# Altium project VOC_Sensor.PrjPcb
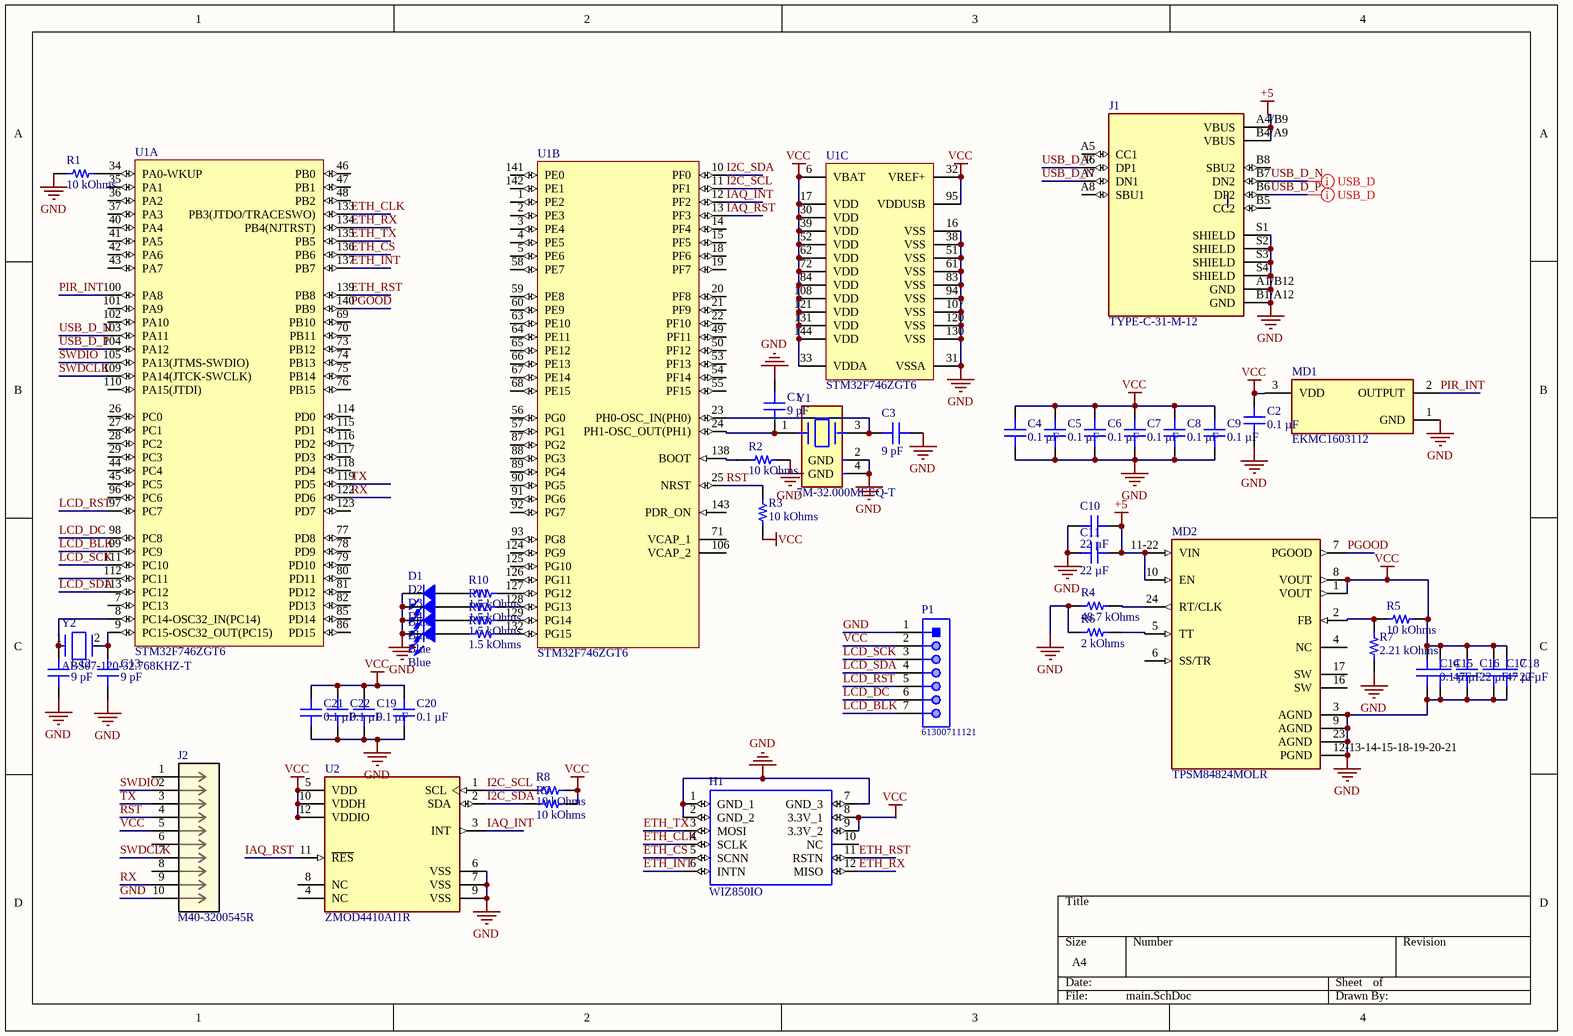
[diagram p0: main.SchDoc]
1 sheet, 49 parts. Net scope: global (net labels, ports and power ports of the same name join across sheets).
Board file: PCB.PcbDoc

## Sheet main.SchDoc
size A4; SheetNumber: 1; SheetTotal: 1

### Parts
C1  9 pF  [CAP 0402_1005]
C2  0.1 µF  [CAP 0402_1005]
C3  9 pF  [CAP 0402_1005]
C4  0.1 µF  [CAP 0402_1005]
C5  0.1 µF  [CAP 0402_1005]
C6  0.1 µF  [CAP 0402_1005]
C7  0.1 µF  [CAP 0402_1005]
C8  0.1 µF  [CAP 0402_1005]
C9  0.1 µF  [CAP 0402_1005]
C10  22 µF  [CAP 0603_1608]
C11  22 µF  [CAP 0603_1608]
C12  9 pF  [CAP 0402_1005]
C13  9 pF  [CAP 0402_1005]
C14  0.1 µF  [CAP 0402_1005]
C15  47 µF  [CAP 1210_3225 - 1MM]
C16  22 µF  [CAP 0603_1608]
C17  47 µF  [CAP 1210_3225 - 1MM]
C18  22 µF  [CAP 0603_1608]
C19  0.1 µF  [CAP 0402_1005]
C20  0.1 µF  [CAP 0402_1005]
C21  0.1 µF  [CAP 0402_1005]
C22  0.1 µF  [CAP 0402_1005]
D1  Blue  [LED 0402_1005 BLUE]
D2  Blue  [LED 0402_1005 BLUE]
D3  Blue  [LED 0402_1005 BLUE]
D4  Blue  [LED 0402_1005 BLUE]
H1  WIZ850IO  [WIZ850IO]
J1  TYPE-C-31-M-12  [HRO_TYPE-C-31-M-12]
J2  M40-3200545R  [CONN10_M40-3200545R_HRW]
MD1  EKMC1603112  [FP-EKMC1603112-MFG]
MD2  TPSM84824MOLR  [FP-MOL0024A-MFG]
P1  61300711121  [61300711121]
R1  10 kOhms  [RES 0402_1005]
R2  10 kOhms  [RES 0402_1005]
R3  10 kOhms  [RES 0402_1005]
R4  48.7 kOhms  [RES 0402_1005]
R5  10 kOhms  [RES 0402_1005]
R6  2 kOhms  [RES 0402_1005]
R7  2.21 kOhms  [RES 0402_1005]
R8  10 kOhms  [RES 0402_1005]
R9  10 kOhms  [RES 0402_1005]
R10  1.5 kOhms  [RES 0402_1005]
R11  1.5 kOhms  [RES 0402_1005]
R12  1.5 kOhms  [RES 0402_1005]
R13  1.5 kOhms  [RES 0402_1005]
U1  STM32F746ZGT6  [STM-LQFP144_V]  (parts A,B,C of 3)
U2  ZMOD4410AI1R  [FP-LGG12D1-MFG]
Y1  7M-32.000MEEQ-T  [FP-7M-MFG]
Y2  ABS07-120-32.768KHZ-T  [FP-ABS07-120-MFG]

### Nets
+5: C10.1 C11.1 J1.A4/B9(VBUS) J1.B4/A9(VBUS) MD2.10(EN) MD2.11-22(VIN)
GND: C1.2 C2.2 C3.2 C4.1 C5.1 C6.1 C7.1 C8.1 C9.1 C10.2 C11.2 C13.2 C14.1 C15.1 C16.1 C17.1 C18.1 C19.1 C20.1 C21.1 C22.1 D1.2 D2.2 D3.2 D4.2 H1.1(GND_1) H1.2(GND_2) H1.7(GND_3) J1.A1/B12(GND) J1.B1/A12(GND) J1.S1(SHIELD) J1.S2(SHIELD) J1.S3(SHIELD) J1.S4(SHIELD) J2.10 MD1.1(GND) MD2.3(AGND) MD2.9(AGND) MD2.12-13-14-15-18-19-20-21(PGND) MD2.23(AGND) P1.1 R1.2 R2.2 R4.1 R6.1 R7.1 U1.16(VSS) U1.31(VSSA) U1.38(VSS) U1.51(VSS) U1.61(VSS) U1.83(VSS) U1.94(VSS) U1.107(VSS) U1.120(VSS) U1.130(VSS) U2.6(VSS) U2.7(VSS) U2.9(VSS) Y1.2(GND) Y1.4(GND)
VCC: C2.1 C4.2 C5.2 C6.2 C7.2 C8.2 C9.2 C14.2 C15.2 C16.2 C17.2 C18.2 C19.2 C20.2 C21.2 C22.2 H1.8(3.3V_1) H1.9(3.3V_2) J2.5 MD1.3(VDD) MD2.1(VOUT) MD2.8(VOUT) P1.2 R3.1 R5.2 R8.1 R9.1 U1.6(VBAT) U1.17(VDD) U1.30(VDD) U1.32(VREF+) U1.33(VDDA) U1.39(VDD) U1.52(VDD) U1.62(VDD) U1.72(VDD) U1.84(VDD) U1.95(VDDUSB) U1.108(VDD) U1.121(VDD) U1.131(VDD) U1.144(VDD) U2.5(VDD) U2.10(VDDH) U2.12(VDDIO)
ETH_CLK: H1.4(SCLK) U1.133(PB3(JTDO/TRACESWO))
ETH_CS: H1.5(SCNN) U1.136(PB6)
ETH_INT: H1.6(INTN) U1.137(PB7)
ETH_RST: H1.11(RSTN) U1.139(PB8)
ETH_RX: H1.12(MISO) U1.134(PB4(NJTRST))
ETH_TX: H1.3(MOSI) U1.135(PB5)
I2C_SCL: R8.2 U1.11(PF1) U2.1(SCL)
I2C_SDA: R9.2 U1.10(PF0) U2.2(SDA)
IAQ_INT: U1.12(PF2) U2.3(INT)
IAQ_RST: U1.13(PF3) U2.11(~{RES})
LCD_BLK: P1.7 U1.99(PC9)
LCD_DC: P1.6 U1.98(PC8)
LCD_RST: P1.5 U1.97(PC7)
LCD_SCK: P1.3 U1.111(PC10)
LCD_SDA: P1.4 U1.113(PC12)
PGOOD: MD2.7(PGOOD) U1.140(PB9)
PIR_INT: MD1.2(OUTPUT) U1.100(PA8)
RST: J2.4 R3.2 U1.25(NRST)
RX: J2.9 U1.122(PD6)
SWDCLK: J2.7 U1.109(PA14(JTCK-SWCLK))
SWDIO: J2.2 U1.105(PA13(JTMS-SWDIO))
TX: J2.3 U1.119(PD5)
USB_D_N: J1.A7(DN1) J1.B7(DN2) U1.103(PA11)
USB_D_P: J1.A6(DP1) J1.B6(DP2) U1.104(PA12)
NetC1_1: C1.1 U1.24(PH1-OSC_OUT(PH1)) Y1.1
NetC3_1: C3.1 U1.23(PH0-OSC_IN(PH0)) Y1.3
NetC12_1: C12.1 U1.8(PC14-OSC32_IN(PC14)) Y2.1
NetC13_1: C13.1 U1.9(PC15-OSC32_OUT(PC15)) Y2.2
NetD1_1: D1.1 R10.1
NetD2_1: D2.1 R11.1
NetD3_1: D3.1 R12.1
NetD4_1: D4.1 R13.1
NetMD2_2: MD2.2(FB) R5.1 R7.2
NetMD2_5: MD2.5(TT) R6.2
NetMD2_24: MD2.24(RT/CLK) R4.2
NetR1_1: R1.1 U1.34(PA0-WKUP)
NetR2_1: R2.1 U1.138(BOOT)
NetR10_2: R10.2 U1.127(PG12)
NetR11_2: R11.2 U1.128(PG13)
NetR12_2: R12.2 U1.129(PG14)
NetR13_2: R13.2 U1.132(PG15)

Not connected (* = marked no-connect by the designer): C12 2; H1 10(NC); J1 A5(CC1) A8(SBU1) B5(CC2) B8(SBU2); J2 1 6 8; MD2 4(NC) 6(SS/TR) 16(SW) 17(SW); U1 1(PE2) 2(PE3) 3(PE4) 4(PE5) 5(PE6) 7(PC13) 14(PF4) 15(PF5) 18(PF6) 19(PF7) 20(PF8) 21(PF9) 22(PF10) 26(PC0) 27(PC1) 28(PC2) 29(PC3) 35(PA1) 36(PA2) 37(PA3) 40(PA4) 41(PA5) 42(PA6) 43(PA7) 44(PC4) 45(PC5) 46(PB0) 47(PB1) 48(PB2) 49(PF11) 50(PF12) 53(PF13) 54(PF14) 55(PF15) 56(PG0) 57(PG1) 58(PE7) 59(PE8) 60(PE9) 63(PE10) 64(PE11) 65(PE12) 66(PE13) 67(PE14) 68(PE15) 69(PB10) 70(PB11) 71(VCAP_1) 73(PB12) 74(PB13) 75(PB14) 76(PB15) 77(PD8) 78(PD9) 79(PD10) 80(PD11) 81(PD12) 82(PD13) 85(PD14) 86(PD15) 87(PG2) 88(PG3) 89(PG4) 90(PG5) 91(PG6) 92(PG7) 93(PG8) 96(PC6) 101(PA9) 102(PA10) 106(VCAP_2) 110(PA15(JTDI)) 112(PC11) 114(PD0) 115(PD1) 116(PD2) 117(PD3) 118(PD4) 123(PD7) 124(PG9) 125(PG10) 126(PG11) 141(PE0) 142(PE1) 143(PDR_ON); U2 4(NC) 8(NC)

### Layout directives
differential pair: USB_D_N, USB_D_P

### Notes on the sheet
- Labels drawn without touching a wire or pin: GND

### Library data of the parts
C1 C3 C12 C13 = 0402N9R0D500CT: CAP CER 9PF 50V C0G/NP0 0402; manufacturer: Walsin Technology Corporation; Temperature Coefficient: C0G, NP0; Tolerance: ±0.5pF; Part Number: 0402N9R0D500CT; Value: 9 pF; Applications: General Purpose; Capacitance: 9 pF; componentlink1description: Datasheet; componentlink1url: http://www.passivecomponent.com/wp-content/uploads/2018/10/MLCC.pdf; componentlink2description: DigiKey Link; componentlink2url: https://www.digikey.com/en/products/detail/walsin-technology-corporation/0402N9R0D500CT/9354861; Device Package: 0402 (1005 Metric); lastupdated: 19/9/2022 12:57:29 pm; Lifecycle Status: Active; Minimum Order: 1; Mounting Type: Surface Mount, MLCC; Operating Temperature: -55°C ~ 125°C; Package / Case: 0402 (1005 Metric); packaging: CutTape; partid: 3535; Part Status: Active; price: 0.01; series: -; Size / Dimension: 0.039" L x 0.020" W (1.00mm x 0.50mm); Supplier 1: DigiKey; Supplier Part Number 1: 1292-1364-1-ND; Thickness (Max): 0.022" (0.55mm); Voltage - Rated: 50V
C2 C4-C9 C14 C19-C22 = 885012105001: CAP CER 0.1UF 6.3V X5R 0402; manufacturer: Würth Elektronik; Tolerance: ±20%; Part Number: 885012105001; Value: 0.1 µF; Applications: General Purpose; Capacitance: 0.1 µF; componentlink1description: Datasheet; componentlink1url: https://katalog.we-online.de/pbs/datasheet/885012105001.pdf; componentlink2description: DigiKey Link; componentlink2url: https://www.digikey.com/en/products/detail/würth-elektronik/885012105001/5453333; Device Package: 0402 (1005 Metric); lastupdated: 19/9/2022 12:57:34 pm; Lifecycle Status: Active; Minimum Order: 1; Mounting Type: Surface Mount, MLCC; Operating Temperature: -55°C ~ 85°C; Package / Case: 0402 (1005 Metric); packaging: TapeAndReel; partid: 1931; Part Status: Active; price: 0.01; series: WCAP-CSGP; Size / Dimension: 0.039" L x 0.020" W (1.00mm x 0.50mm); Supplier 1: DigiKey; Supplier Part Number 1: 732-7478-1-ND; Temperature Coefficient: X5R; Thickness (Max): 0.022" (0.55mm); Voltage - Rated: 6.3V
C10 C11 C16 C18 = ZRB18AR61A226ME01L: CAP CER 22UF 10V X5R 0603; manufacturer: Murata Electronics; Tolerance: ±20%; Part Number: ZRB18AR61A226ME01L; Value: 22 µF; Applications: Acoustic Noise Reduction; Capacitance: 22 µF; componentlink1description: Datasheet; componentlink1url: https://search.murata.co.jp/Ceramy/image/img/A01X/G101/ENG/ZRB18AR61A226ME01-02.pdf; componentlink2description: DigiKey Link; componentlink2url: https://www.digikey.com/en/products/detail/murata-electronics/ZRB18AR61A226ME01L/7243452; Device Package: 0603 (1608 Metric); Features: Interposer Termination; lastupdated: 19/9/2022 1:00:06 pm; Lifecycle Status: Active; Minimum Order: 1; Mounting Type: Surface Mount, MLCC; Operating Temperature: -55°C ~ 85°C; Package / Case: 0603 (1608 Metric); packaging: TapeAndReel; partid: 34379; Part Status: Active; price: 0.07; series: ZRB; Size / Dimension: 0.063" L x 0.031" W (1.60mm x 0.80mm); Supplier 1: DigiKey; Supplier Part Number 1: 490-ZRB18AR61A226ME01LCT-ND; Temperature Coefficient: X5R; Thickness (Max): 0.047" (1.20mm); Voltage - Rated: 10V
C15 C17 = GRM32EC81C476KE15L: CAP CER 47UF 16V X6S 1210; manufacturer: Murata Electronics; Tolerance: ±10%; Part Number: GRM32EC81C476KE15L; Value: 47 µF; Applications: General Purpose; Capacitance: 47 µF; componentlink1description: Datasheet; componentlink1url: https://search.murata.co.jp/Ceramy/image/img/A01X/G101/ENG/GRM32EC81C476KE15-01.pdf; componentlink2description: DigiKey Link; componentlink2url: https://www.digikey.com/en/products/detail/murata-electronics/GRM32EC81C476KE15L/5027615; Device Package: 1210 (3225 Metric); lastupdated: 19/9/2022 1:23:34 pm; Lifecycle Status: Active; Minimum Order: 1; Mounting Type: Surface Mount, MLCC; Operating Temperature: -55°C ~ 105°C; Package / Case: 1210 (3225 Metric); packaging: TapeAndReel; partid: 23627; Part Status: Active; price: 0.13; series: GRM; Size / Dimension: 0.126" L x 0.098" W (3.20mm x 2.50mm); Supplier 1: DigiKey; Supplier Part Number 1: 490-10531-1-ND; Temperature Coefficient: X6S; Thickness (Max): 0.106" (2.70mm); Voltage - Rated: 16V
D1-D4 = B1811NB--05D000113U1930: 1.0(L)X0.5(W)X0.25(H) MM; Manufacturer: Harvatek Corporation; Current - Test: 5mA; Lens Size: 1.00mm x 0.50mm; Lens Style: Rectangle with Flat Top; Lens Transparency: Diffused; Millicandela Rating: 28.5mcd; Viewing Angle: 100°, 130°; Voltage - Forward (Vf) (Typ): 2.8V; Wavelength - Dominant: 472nm; Wavelength - Peak: 470nm; Part Number: B1811NB--05D000113U1930; Color: Blue; ComponentLink1Description: Datasheet; ComponentLink1URL: https://media.digikey.com/pdf/Data%20Sheets/Harvatek%20PDFs/B1811NB--05D000113U1930.pdf; ComponentLink2Description: DigiKey Link; ComponentLink2URL: https://www.digikey.com/en/products/detail/harvatek-corporation/B1811NB-05D000113U1930/16573079; Device Package: 0402 (1005 Metric); Height (Max): 0.35mm; LastUpdated: 19/9/2022 1:49:16 pm; Lifecycle Status: Active; Minimum Order: 1; Mounting Type: Surface Mount; Package / Case: 0402 (1005 Metric); Packaging: TapeAndReel; PartId: 1112; Part Status: Active; Price: 0.09; Series: -; Size / Dimension: 1.00mm L x 0.50mm W; Supplier 1: DigiKey; Supplier Part Number 1: 3147-B1811NB--05D000113U1930CT-ND; Value: Blue
H1 = WIZ850IO: Ethernet - 10/100 Base-T/TX PHY SPI Interface Module; MF: WIZnet; Value: *; Package: Module WIZnet; Availability: In Stock; Check_prices: https://www.snapeda.com/parts/WIZ850IO/WIZnet/view-part/?ref=eda; SnapEDA_Link: https://www.snapeda.com/parts/WIZ850IO/WIZnet/view-part/?ref=snap; Purchase-URL: https://pricing.snapeda.com/search/part/WIZ850IO/?ref=eda; MP: WIZ850IO; Price: None
J1 = TYPE-C-31-M-12: USB Connectors 24 Receptacle 1 8.94*7.3mm RoHS; MF: HRO Electronics Co., Ltd.; Package: Package; Price: None; Availability: Not in stock; Check_prices: https://www.snapeda.com/parts/TYPE-C-31-M-12/HRO+Electronics+Co.%252C+Ltd./view-part/?ref=eda; MP: TYPE-C-31-M-12; SnapEDA_Link: https://www.snapeda.com/parts/TYPE-C-31-M-12/HRO+Electronics+Co.%252C+Ltd./view-part/?ref=snap; Value: *
J2 = M40-3200545R: No Description Available; Mfr_Name: Harwin; Copyright: Copyright (C) 2022 Ultra Librarian. All rights reserved.; Manufacturer_Part_Number: M40-3200545R; RefDes: RefDes; Type: DEV
MD1 = CMP-05541-000002-1: SENSOR MOTION PIR 12M RANGE BLK; Manufacturer: Panasonic Electric Works; Sensor Output: TTL; Min Supply Voltage: 3V; Operating Supply Current: 170uA; Max Supply Voltage: 6V; ComponentLink2Description: Datasheet; Ambient Temperature Range High: +60°C; Digikey Description: SENSOR MOTION PIR 12M RANGE BLK; Device Class L3: unset; ComponentLink2URL: https://www3.panasonic.biz/ac/ae/search_num/index.jsp?c=detail&part_no=EKMC1603112; Category: UNK; Height: 20.2mm; Octopart: https://octopart.com/ekmc1603112-panasonic-19688871; Ambient Temperature Range Low: -20°C; Lead Free: Yes; Automotive: No; Package: 0; RoHS: TRUE; Device Class L1: Sensors; Mouser Description: Board Mount Motion & Position Sensors 170uA 12m Digital Black lens; Device Class L2: Motion Sensors; Manufacturer Part Number: EKMC1603112
MD2 = CMP-04918-000322-1: DC DC CONVERTER 0.6-10V; Max Input Voltage: 17V; Voltage - Output 1: 10V; Number of Outputs: 1; Min Input Voltage: 4.5V; Max Output Current: 8A; Efficiency: 94%; Mount: Surface Mount; Max Operating Temperature: 105°C; Min Operating Temperature: -40°C; RoHS Compliant: Yes; Packaging: Tape and Reel; Case/Package: SMD/SMT; Features: UVLO
P1 = CMP-1502-01074-1: THT Vertical Pin Header WR-PHD, Pitch 2.54 mm, Single Row, 7 pins; Manufacturer: Wurth Elektronik; Pin Number: 7; Gender: Male; Working Voltage: 250VAC; Contact Resistance: 20mOhm; Rated Current: 3A; Pitch: 2.54mm; Withstanding Voltage: 500VAC; Row Number: Single; Packaging: Bag; Orientation: Vertical; Manufacturer URL: http://www.we-online.de; Datasheet URL: https://katalog.we-online.de/em/datasheet/6130xx11121.pdf; Part Number: 61300711121; Publisher: WurthElektronik; Operating Temperature: -40to105degC; Mounting Technology: THT; Package Reference: 61300711121
R1-R3 R5 R8 R9 = AC0402FR-7W10KL: RES 10 KOHM 1% 1/8W 0402; Manufacturer: Yageo; Power (Watts): 0.125W, 1/8W; Temperature Coefficient: ±100ppm/°C; Part Number: AC0402FR-7W10KL; Value: 10 kOhms; ComponentLink1Description: Datasheet; ComponentLink1URL: https://www.yageo.com/upload/media/product/productsearch/datasheet/rchip/PYu-AC_51_RoHS_L_8.pdf; ComponentLink2Description: DigiKey Link; ComponentLink2URL: https://www.digikey.com/en/products/detail/yageo/AC0402FR-7W10KL/12698852; Composition: Thick Film; Device Package: 0402 (1005 Metric); Features: Automotive AEC-Q200, Moisture Resistant; Height - Seated (Max): 0.015" (0.37mm); LastUpdated: 19/9/2022 1:13:40 pm; Lifecycle Status: Active; Minimum Order: 1; Number of Terminations: 2; Operating Temperature: -55°C ~ 155°C; Package / Case: 0402 (1005 Metric); Packaging: CutTape; PartId: 66973; Part Status: Active; Price: 0.01; Ratings: AEC-Q200; Resistance: 10 kOhms; Series: AC; Size / Dimension: 0.039" L x 0.020" W (1.00mm x 0.50mm); Supplier 1: DigiKey; Supplier Part Number 1: 13-AC0402FR-7W10KLCT-ND; Supplier Device Package: 0402; Tolerance: ±1%
R4 = RP73PF1E48K7BTD: RES 48.7K OHM 0.1% 1/10W 0402; Manufacturer: TE Connectivity Passive Product; Power (Watts): 0.1W, 1/10W; Temperature Coefficient: ±25ppm/°C; Part Number: RP73PF1E48K7BTD; Value: 48.7 kOhms; ComponentLink1Description: Datasheet; ComponentLink1URL: https://www.te.com/commerce/DocumentDelivery/DDEController?Action=srchrtrv&DocNm=1773272&DocType=DS&DocLang=English; ComponentLink2Description: DigiKey Link; ComponentLink2URL: https://www.digikey.com/en/products/detail/te-connectivity-passive-product/RP73PF1E48K7BTD/8261023; Composition: Thin Film; Device Package: 0402 (1005 Metric); Height - Seated (Max): 0.014" (0.35mm); LastUpdated: 19/9/2022 1:14:09 pm; Lifecycle Status: Active; Minimum Order: 1; Number of Terminations: 2; Operating Temperature: -55°C ~ 155°C; Package / Case: 0402 (1005 Metric); Packaging: TapeAndReel; PartId: 19282; Part Status: Active; Price: 0.09; Resistance: 48.7 kOhms; Series: RP73, Holsworthy; Size / Dimension: 0.039" L x 0.020" W (1.00mm x 0.50mm); Supplier 1: DigiKey; Supplier Part Number 1: A127481CT-ND; Supplier Device Package: 0402; Tolerance: ±0.1%
R6 = RE0402BRE072KL: CHIP RESISTOR THICK FILM PRECISI; Manufacturer: Yageo; Power (Watts): 0.063W, 1/16W; Temperature Coefficient: ±50ppm/°C; Tolerance: ±0.1%; Part Number: RE0402BRE072KL; Value: 2 kOhms; ComponentLink1Description: Datasheet; ComponentLink1URL: https://www.yageo.com/upload/media/product/productsearch/datasheet/rchip/PYu-RE_105_RoHS_L_6.pdf; ComponentLink2Description: DigiKey Link; ComponentLink2URL: https://www.digikey.com/en/products/detail/yageo/RE0402BRE072KL/15220230; Composition: Thick Film; Device Package: 0402 (1005 Metric); Height - Seated (Max): 0.015" (0.37mm); LastUpdated: 19/9/2022 1:13:39 pm; Lifecycle Status: Active; Minimum Order: 1; Number of Terminations: 2; Operating Temperature: -55°C ~ 155°C; Package / Case: 0402 (1005 Metric); Packaging: TapeAndReel; PartId: 67348; Part Status: Active; Price: 0.05; Resistance: 2 kOhms; Series: RE; Size / Dimension: 0.039" L x 0.020" W (1.00mm x 0.50mm); Supplier 1: DigiKey; Supplier Part Number 1: 13-RE0402BRE072KLCT-ND; Supplier Device Package: 0402
R7 = RP73PF1E2K21BTD: RES 2.21K OHM 0.1% 1/10W 0402; Manufacturer: TE Connectivity Passive Product; Power (Watts): 0.1W, 1/10W; Temperature Coefficient: ±25ppm/°C; Part Number: RP73PF1E2K21BTD; Value: 2.21 kOhms; ComponentLink1Description: Datasheet; ComponentLink1URL: https://www.te.com/commerce/DocumentDelivery/DDEController?Action=srchrtrv&DocNm=1773272&DocType=DS&DocLang=English; ComponentLink2Description: DigiKey Link; ComponentLink2URL: https://www.digikey.com/en/products/detail/te-connectivity-passive-product/RP73PF1E2K21BTD/8260894; Composition: Thin Film; Device Package: 0402 (1005 Metric); Height - Seated (Max): 0.014" (0.35mm); LastUpdated: 19/9/2022 1:13:59 pm; Lifecycle Status: Active; Minimum Order: 1; Number of Terminations: 2; Operating Temperature: -55°C ~ 155°C; Package / Case: 0402 (1005 Metric); Packaging: TapeAndReel; PartId: 21716; Part Status: Active; Price: 0.09; Resistance: 2.21 kOhms; Series: RP73, Holsworthy; Size / Dimension: 0.039" L x 0.020" W (1.00mm x 0.50mm); Supplier 1: DigiKey; Supplier Part Number 1: A127352CT-ND; Supplier Device Package: 0402; Tolerance: ±0.1%
R10-R13 = ERA-2VRW1501X: RES 1.5K OHM 0.05% 1/10W 0402; Manufacturer: Panasonic Electronic Components; Power (Watts): 0.1W, 1/10W; Temperature Coefficient: ±10ppm/°C; Part Number: ERA-2VRW1501X; Value: 1.5 kOhms; ComponentLink1Description: Datasheet; ComponentLink1URL: https://api.pim.na.industrial.panasonic.com/file_stream/main/fileversion/9152; ComponentLink2Description: DigiKey Link; ComponentLink2URL: https://www.digikey.com/en/products/detail/panasonic-electronic-components/ERA-2VRW1501X/12086957; Composition: Thin Film; Device Package: 0402 (1005 Metric); Features: Anti-Sulfur, Automotive AEC-Q200; Height - Seated (Max): 0.016" (0.40mm); LastUpdated: 19/9/2022 1:13:39 pm; Lifecycle Status: Active; Minimum Order: 1; Number of Terminations: 2; Operating Temperature: -55°C ~ 155°C; Package / Case: 0402 (1005 Metric); Packaging: TapeAndReel; PartId: 67400; Part Status: Active; Price: 0.24; Ratings: AEC-Q200; Resistance: 1.5 kOhms; Series: ERA-2V; Size / Dimension: 0.039" L x 0.020" W (1.00mm x 0.50mm); Supplier 1: DigiKey; Supplier Part Number 1: 10-ERA-2VRW1501XCT-ND; Supplier Device Package: 0402; Tolerance: ±0.05%
U1 = CMP-1570-00007-1: ARM-Based Cortex-M7 32 Bit MCU+FPU, 462 DMIPS, 1024 kB Flash, 320 kB RAM, 114 I/Os, -40 to 85 degC, 144-Pin LQFP, Halogen-Free, Tray; Program Memory Size: 1024 KByte; Data RAM Size: 320 KByte; Supply Voltage Max: 3.6 V; Number of I/Os: 114; Supply Voltage Min: 1.7 V; Clock Frequency Max: 216 MHz; L1 Cache Instruction Memory: 4 KByte; PackageDescription: 144-Pin Low Profile Quad Flat Package, 20 x 20 mm Body, 0.5 mm Pitch; ComponentLink1Description: Manufacturer URL; Mounting Technology: Surface Mount; PartNumber: STM32F746ZG; ComponentLink1URL: http://www.st.com/web/en/home.html; Temperature Min: -40 degC; Packing: Tray; ComponentLink2Description: Datasheet; Temperature Max: 85 degC; ComponentLink3URL: http://www.st.com/st-web-ui/static/active/en/resource/technical/document/datasheet/DM00037051.pdf; ComponentLink3Description: Package Specification; L1 Cache Data Memory: 4 KByte; DatasheetVersion: Rev. 1; ComponentLink2URL: http://www.st.com/st-web-ui/static/active/en/resource/technical/document/datasheet/DM00166116.pdf
U2 = CMP-13577-000002-1: TVOC IAQ INTEGRATED SENSOR
Y1 = CMP-18717-000043-1: Crystal 32MHz, 10ppm, 10pF, 50Ω; ESR (Equivalent Series Resistance): 60R; Height: 0.031inch; Load Capacitance: 10pF; Tolerance: 10ppm; Frequency: 32MHz; Frequency Stability: 10ppm; Termination: SMD/SMT; Width: 0.098inch; Packaging: Tape and Reel; Package Quantity: 3000; Mount: Surface Mount; Max Operating Temperature: 70°C; Series: 7M; Min Operating Temperature: -20°C; Number of Pins: 4; Depth: 2.5mm; Case/Package: SMD/SMT; Frequency Tolerance: 10ppm; Length: 3.2mm; REACH SVHC: No SVHC
Y2 = CMP-2000-07587-2: CRYSTAL 32.7680KHZ 6PF SMD; Frequency Tolerance: 20ppm; Series Resistance: 60kR; ESR (Equivalent Series Resistance): 55kR; Depth: 1.5mm; Width: 0.061inch; Number of Pins: 2; Max Operating Temperature: 85°C; Length: 3.2mm; Case/Package: SMD/SMT; Series: ABS07; Lead Free: Lead Free; Min Operating Temperature: -40°C; Load Capacitance: 6pF; Packaging: Tape and Reel; Height: 0.035inch; Radiation Hardening: No; Tolerance: 20ppm; Operating Frequency: 32.768 kHz; Termination: SMD/SMT; REACH SVHC: No SVHC; RoHS Compliant: Yes; Frequency: 32.768kHz; Package Quantity: 3000; Mount: Surface Mount